# EAGLE schematic VNH2SP30 (EAGLE 7.2.0)
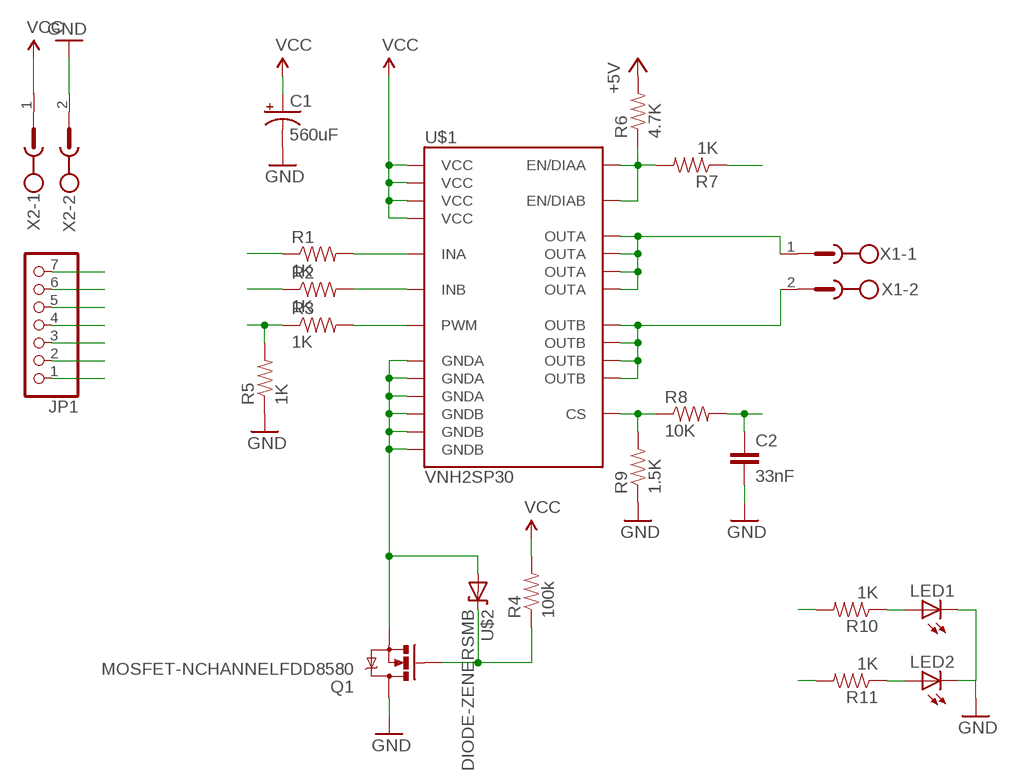
[diagram p0: schematic, sheet 1]

## Parts
C1  560uF  CAP_POLG  [PANASONIC_G]
C2  33nF  CAP1206  [1206]
JP1  PINHD-1X7  [1X07]
LED1  LEDCHIPLED_1206  [CHIPLED_1206]
LED2  LEDCHIPLED_1206  [CHIPLED_1206]
Q1  MOSFET-NCHANNELFDD8580  [DPAK]
R1  1K  RESISTOR1206  [1206]
R2  1K  RESISTOR1206  [1206]
R3  1K  RESISTOR1206  [1206]
R4  100k  RESISTOR1206  [1206]
R5  1K  RESISTOR1206  [1206]
R6  4.7K  RESISTOR1206  [1206]
R7  1K  RESISTOR1206  [1206]
R8  10K  RESISTOR1206  [1206]
R9  1.5K  RESISTOR1206  [1206]
R10  1K  RESISTOR1206  [1206]
R11  1K  RESISTOR1206  [1206]
U$1  VNH2SP30  [VNH2SP30]
U$2  DIODE-ZENERSMB  [SMB-DIODE]
X1  MSTBV2  [MSTBV2]
X2  MSTBV2  [MSTBV2]

## Nets
+5V: JP1.7 R6.2
CS: C2.1 JP1.2 R8.2
EN: JP1.6 R7.1
GND: C1.- C2.2 JP1.1 LED1.C LED2.C Q1.4(D) R5.1 R9.1 X2.2
INA: JP1.5 R1.1
INB: JP1.4 R2.1
N$2: Q1.3(S) U$1.18(GNDB) U$1.19(GNDB) U$1.20(GNDB) U$1.26(GNDA) U$1.27(GNDA) U$1.28(GNDA) U$2.A
N$3: R1.2 U$1.5(INA)
N$4: R2.2 U$1.11(INB)
N$5: R3.2 U$1.8(PWM)
N$6: Q1.1(G) R4.1 U$2.C
N$11: R8.1 R9.2 U$1.9(CS)
N$12: R6.1 R7.2 U$1.6(EN/DIAA) U$1.10(EN/DIAB)
N$32: LED2.A R11.1
N$34: LED1.A R10.1
OUTA: R11.2 U$1.1(OUTA) U$1.25(OUTA) U$1.30(OUTA) U$1.SLUG3(OUTA) X1.1
OUTB: R10.2 U$1.15(OUTB) U$1.16(OUTB) U$1.21(OUTB) U$1.SLUG2(OUTB) X1.2
PWM: JP1.3 R3.1 R5.2
VCC: C1.+ R4.2 U$1.3(VCC) U$1.13(VCC) U$1.23(VCC) U$1.SLUG1(VCC) X2.1

## Library data of the parts
C1 = SparkFun:CAP_POL: Capacitor Polarized These are standard SMD and PTH capacitors. Normally 10uF, 47uF, and 100uF in electrolytic and tantalum varieties. Always verify the external diameter of the through hole cap, it varies with capacity, voltage, and manufacturer. The EIA devices should be standard.
C2 = SparkFun:CAP: Capacitor Standard 0603 ceramic capacitor, and 0.1" leaded capacitor.
JP1 = pinhead:PINHD-1X7: PIN HEADER
LED1 LED2 = led:LED: LED OSRAM: - CHIPLED LG R971, LG N971, LY N971, LG Q971, LY Q971, LO R971, LY R971 LH N974, LH R974 LS Q976, LO Q976, LY Q976 LO Q996 - Hyper CHIPLED LW Q18S LB Q993, LB Q99A, LB R99A - SideLED LS A670, LO A670, LY A670, LG A670, LP A670 LB A673, LV A673, LT A673, LW A673 LH A674 LY A675 LS A676, LA A676, LO A676, LY A676, LW A676 LS A679, LY A679, LG A679 - Hyper Micro SIDELED® LS Y876, LA Y876, LO Y876, LY Y876 LT Y87S - SmartLED LW L88C, LW L88S LB L89C, LB L89S, LG L890 LS L89K, LO L89K, LY L89K LS L896, LA L896, LO L896, LY L896 - TOPLED LS T670, LO T670, LY T670, LG T670, LP T670 LSG T670, LSP T670, LSY T670, LOP T670, LYG T670 LG T671, LOG T671, LSG T671 LB T673, LV T673, LT T673, LW T673 LH T674 LS T676, LA T676, LO T676, LY T676, LB T676, LH T676, LSB T676, LW T676 LB T67C, LV T67C, LT T67C, LS T67K, LO T67K, LY T67K, LW E67C LS E67B, LA E67B, LO E67B, LY E67B, LB E67C, LV E67C, LT E67C LW T67C LS T679, LY T679, LG T679 LS T770, LO T770, LY T770, LG T770, LP T770 LB T773, LV T773, LT T773, LW T773 LH T774 LS E675, LA E675, LY E675, LS T675 LS T776, LA T776, LO T776, LY T776, LB T776 LHGB T686 LT T68C, LB T68C - Hyper Mini TOPLED® LB M676 - Mini TOPLED Santana® LG M470 LS M47K, LO M47K, LY M47K Source: http://www.osram.convergy.de LUXEON: - LUMILED® LXK2-PW12-R00, LXK2-PW12-S00, LXK2-PW14-U00, LXK2-PW14-V00 LXK2-PM12-R00, LXK2-PM12-S00, LXK2-PM14-U00 LXK2-PE12-Q00, LXK2-PE12-R00, LXK2-PE12-S00, LXK2-PE14-T00, LXK2-PE14-U00 LXK2-PB12-K00, LXK2-PB12-L00, LXK2-PB12-M00, LXK2-PB14-N00, LXK2-PB14-P00, LXK2-PB14-Q00 LXK2-PR12-L00, LXK2-PR12-M00, LXK2-PR14-Q00, LXK2-PR14-R00 LXK2-PD12-Q00, LXK2-PD12-R00, LXK2-PD12-S00 LXK2-PH12-R00, LXK2-PH12-S00 LXK2-PL12-P00, LXK2-PL12-Q00, LXK2-PL12-R00 Source: www.luxeon.com KINGBRIGHT: KA-3528ASYC Source: www.kingbright.com
Q1 = SparkFun:MOSFET-NCHANNEL
R1-R11 = SparkFun:RESISTOR: Resistor Basic schematic elements and footprints for 0603, 1206, and PTH 1/10th watt (small) resistors.
U$1 = SparkFun:VNH2SP30
U$2 = SparkFun:DIODE-ZENER: Zener Diode Production Part - 8199 3.4V Zener Voltage
X1 X2 = con-phoenix-500:MSTBV2: PHOENIX; OC_FARNELL: unknown; OC_NEWARK: unknown